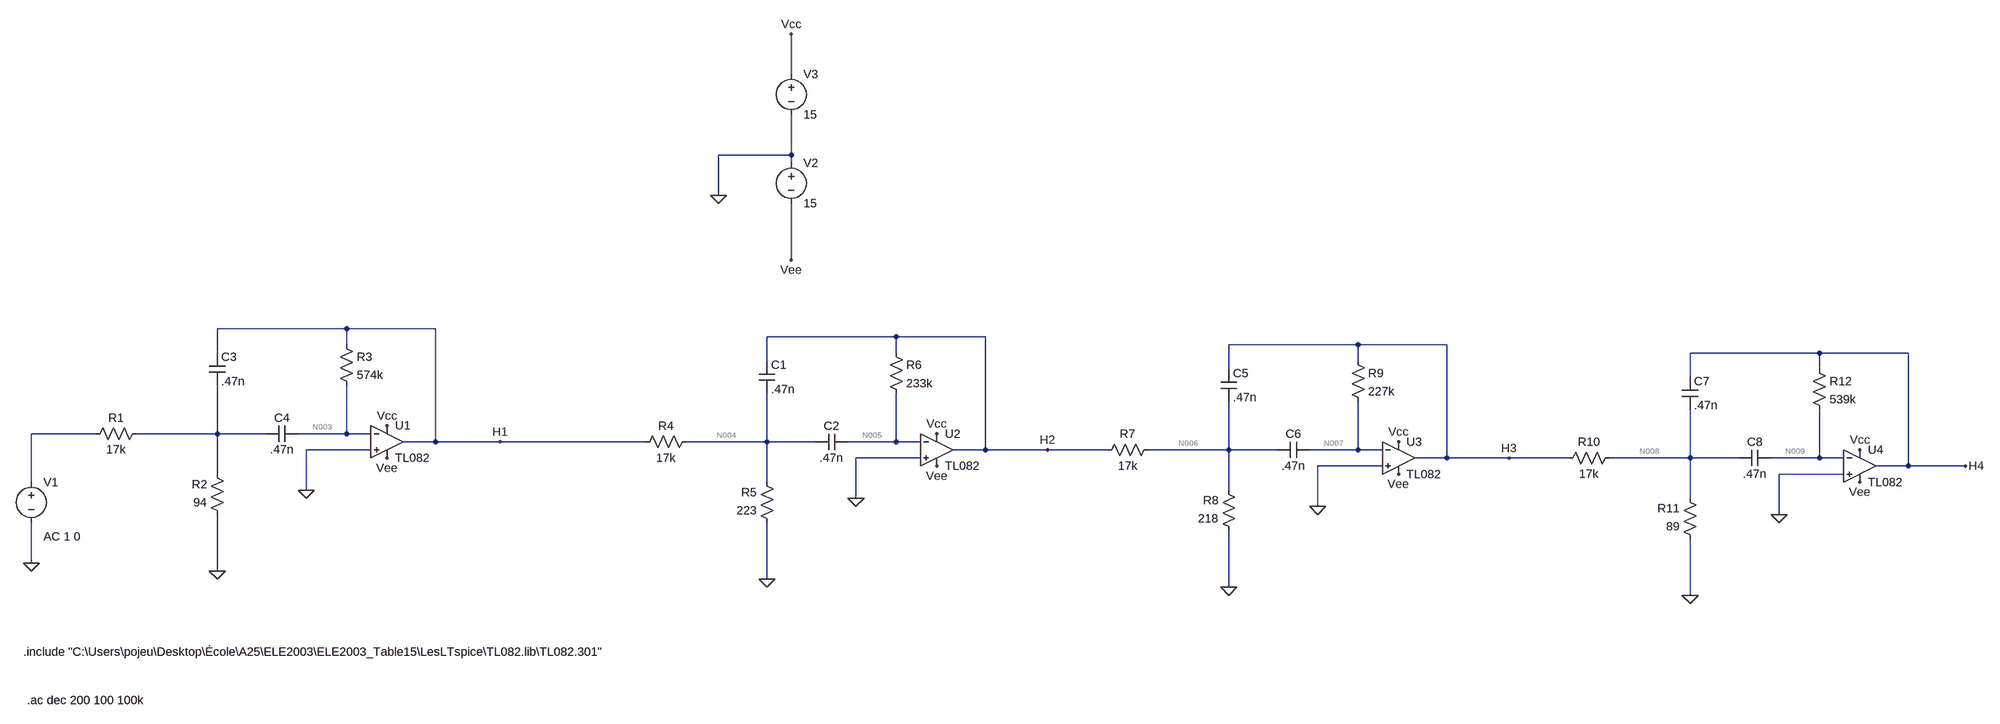
[diagram p0: schematic Filtres assembles.asc]
Filtres assembles.asc, the LTspice schematic file:
Version 4.1
SHEET 1 4064 1060
WIRE 592 -1104 592 -1184
WIRE 592 -944 592 -1024
WIRE 592 -944 448 -944
WIRE 592 -928 592 -944
WIRE 448 -864 448 -944
WIRE 592 -736 592 -848
WIRE -288 -400 -544 -400
WIRE -112 -400 -288 -400
WIRE 800 -384 544 -384
WIRE 976 -384 800 -384
WIRE -288 -368 -288 -400
WIRE 1744 -368 1488 -368
WIRE 1920 -368 1744 -368
WIRE -544 -352 -544 -400
WIRE 800 -352 800 -384
WIRE 2832 -352 2576 -352
WIRE 3008 -352 2832 -352
WIRE 544 -336 544 -384
WIRE 1744 -336 1744 -368
WIRE 1488 -320 1488 -368
WIRE 2832 -320 2832 -352
WIRE 2576 -304 2576 -352
WIRE -784 -192 -912 -192
WIRE -544 -192 -544 -288
WIRE -544 -192 -704 -192
WIRE -448 -192 -544 -192
WIRE -288 -192 -288 -288
WIRE -288 -192 -384 -192
WIRE -240 -192 -288 -192
WIRE -112 -176 -112 -400
WIRE -112 -176 -176 -176
WIRE 16 -176 -112 -176
WIRE 304 -176 16 -176
WIRE 544 -176 544 -272
WIRE 544 -176 384 -176
WIRE 640 -176 544 -176
WIRE 800 -176 800 -272
WIRE 800 -176 704 -176
WIRE 848 -176 800 -176
WIRE -240 -160 -368 -160
WIRE 976 -160 976 -384
WIRE 976 -160 912 -160
WIRE 1104 -160 976 -160
WIRE 1248 -160 1104 -160
WIRE 1488 -160 1488 -256
WIRE 1488 -160 1328 -160
WIRE 1584 -160 1488 -160
WIRE 1744 -160 1744 -256
WIRE 1744 -160 1648 -160
WIRE 1792 -160 1744 -160
WIRE 848 -144 720 -144
WIRE 1920 -144 1920 -368
WIRE 1920 -144 1856 -144
WIRE 2048 -144 1920 -144
WIRE 2336 -144 2048 -144
WIRE 2576 -144 2576 -240
WIRE 2576 -144 2416 -144
WIRE 2672 -144 2576 -144
WIRE 2832 -144 2832 -240
WIRE 2832 -144 2736 -144
WIRE 2880 -144 2832 -144
WIRE 1792 -128 1664 -128
WIRE 3008 -128 3008 -352
WIRE 3008 -128 2944 -128
WIRE 3136 -128 3008 -128
WIRE -544 -112 -544 -192
WIRE 2880 -112 2752 -112
WIRE -912 -96 -912 -192
WIRE 544 -96 544 -176
WIRE -368 -80 -368 -160
WIRE 1488 -80 1488 -160
WIRE 720 -64 720 -144
WIRE 2576 -64 2576 -144
WIRE 1664 -48 1664 -128
WIRE 2752 -32 2752 -112
WIRE -912 64 -912 -16
WIRE -544 80 -544 -32
WIRE 544 96 544 -16
WIRE 1488 112 1488 0
WIRE 2576 128 2576 16
FLAG -544 80 0
FLAG -912 64 0
FLAG 448 -864 0
FLAG 592 -1184 Vcc
FLAG 592 -736 Vee
FLAG -208 -208 Vcc
FLAG -208 -144 Vee
FLAG -368 -80 0
FLAG 544 96 0
FLAG 880 -192 Vcc
FLAG 880 -128 Vee
FLAG 720 -64 0
FLAG 1488 112 0
FLAG 1824 -176 Vcc
FLAG 1824 -112 Vee
FLAG 1664 -48 0
FLAG 2576 128 0
FLAG 2912 -160 Vcc
FLAG 2912 -96 Vee
FLAG 2752 -32 0
FLAG 16 -176 H1
FLAG 1104 -160 H2
FLAG 2048 -144 H3
FLAG 3136 -128 H4
SYMBOL res -688 -208 R90
WINDOW 0 0 56 VBottom 2
WINDOW 3 32 56 VTop 2
SYMATTR InstName R1
SYMATTR Value 17k
SYMBOL res -528 -16 R180
WINDOW 0 36 76 Left 2
WINDOW 3 36 40 Left 2
SYMATTR InstName R2
SYMATTR Value 94
SYMBOL cap -560 -352 R0
SYMATTR InstName C3
SYMATTR Value .47n
SYMBOL cap -384 -208 R90
WINDOW 0 0 32 VBottom 2
WINDOW 3 32 32 VTop 2
SYMATTR InstName C4
SYMATTR Value .47n
SYMBOL res -304 -384 R0
SYMATTR InstName R3
SYMATTR Value 574k
SYMBOL voltage -912 -112 R0
WINDOW 123 24 124 Left 2
WINDOW 39 0 0 Left 0
SYMATTR Value2 AC 1 0
SYMATTR InstName V1
SYMATTR Value ""
SYMBOL voltage 592 -944 R0
SYMATTR InstName V2
SYMATTR Value 15
SYMBOL voltage 592 -1120 R0
SYMATTR InstName V3
SYMATTR Value 15
SYMBOL OpAmps\\opamp2 -208 -240 R0
SYMATTR InstName U1
SYMATTR Value TL082
SYMBOL res 400 -192 R90
WINDOW 0 0 56 VBottom 2
WINDOW 3 32 56 VTop 2
SYMATTR InstName R4
SYMATTR Value 17k
SYMBOL res 560 0 R180
WINDOW 0 36 76 Left 2
WINDOW 3 36 40 Left 2
SYMATTR InstName R5
SYMATTR Value 223
SYMBOL cap 528 -336 R0
SYMATTR InstName C1
SYMATTR Value .47n
SYMBOL cap 704 -192 R90
WINDOW 0 0 32 VBottom 2
WINDOW 3 32 32 VTop 2
SYMATTR InstName C2
SYMATTR Value .47n
SYMBOL res 784 -368 R0
SYMATTR InstName R6
SYMATTR Value 233k
SYMBOL OpAmps\\opamp2 880 -224 R0
SYMATTR InstName U2
SYMATTR Value TL082
SYMBOL res 1344 -176 R90
WINDOW 0 0 56 VBottom 2
WINDOW 3 32 56 VTop 2
SYMATTR InstName R7
SYMATTR Value 17k
SYMBOL res 1504 16 R180
WINDOW 0 36 76 Left 2
WINDOW 3 36 40 Left 2
SYMATTR InstName R8
SYMATTR Value 218
SYMBOL cap 1472 -320 R0
SYMATTR InstName C5
SYMATTR Value .47n
SYMBOL cap 1648 -176 R90
WINDOW 0 0 32 VBottom 2
WINDOW 3 32 32 VTop 2
SYMATTR InstName C6
SYMATTR Value .47n
SYMBOL res 1728 -352 R0
SYMATTR InstName R9
SYMATTR Value 227k
SYMBOL OpAmps\\opamp2 1824 -208 R0
SYMATTR InstName U3
SYMATTR Value TL082
SYMBOL res 2432 -160 R90
WINDOW 0 0 56 VBottom 2
WINDOW 3 32 56 VTop 2
SYMATTR InstName R10
SYMATTR Value 17k
SYMBOL res 2592 32 R180
WINDOW 0 36 76 Left 2
WINDOW 3 36 40 Left 2
SYMATTR InstName R11
SYMATTR Value 89
SYMBOL cap 2560 -304 R0
SYMATTR InstName C7
SYMATTR Value .47n
SYMBOL cap 2736 -160 R90
WINDOW 0 0 32 VBottom 2
WINDOW 3 32 32 VTop 2
SYMATTR InstName C8
SYMATTR Value .47n
SYMBOL res 2816 -336 R0
SYMATTR InstName R12
SYMATTR Value 539k
SYMBOL OpAmps\\opamp2 2912 -192 R0
SYMATTR InstName U4
SYMATTR Value TL082
TEXT -928 240 Left 2 !.include "C:\\Users\\pojeu\\Desktop\\École\\A25\\ELE2003\\ELE2003_Table15\\LesLTspice\\TL082.lib\\TL082.301"
TEXT -920 336 Left 2 !.ac dec 200 100 100k

The netlist it stands for:
* Filtres assembles.asc
R1 N002 N001 17k
R2 0 N002 94
C3 H1 N002 .47n
C4 N003 N002 .47n
R3 H1 N003 574k
V1 N001 0 AC 1 0
V2 0 Vee 15
V3 Vcc 0 15
X§U1 0 N003 Vcc Vee H1 TL082  ; pins In+ In- V+ V- OUT
R4 N004 H1 17k
R5 0 N004 223
C1 H2 N004 .47n
C2 N005 N004 .47n
R6 H2 N005 233k
X§U2 0 N005 Vcc Vee H2 TL082  ; pins In+ In- V+ V- OUT
R7 N006 H2 17k
R8 0 N006 218
C5 H3 N006 .47n
C6 N007 N006 .47n
R9 H3 N007 227k
X§U3 0 N007 Vcc Vee H3 TL082  ; pins In+ In- V+ V- OUT
R10 N008 H3 17k
R11 0 N008 89
C7 H4 N008 .47n
C8 N009 N008 .47n
R12 H4 N009 539k
X§U4 0 N009 Vcc Vee H4 TL082  ; pins In+ In- V+ V- OUT
.include "C:\Users\pojeu\Desktop\École\A25\ELE2003\ELE2003_Table15\LesLTspice\TL082.lib\TL082.301"
.ac dec 200 100 100k
.backanno
.end

* Results of the author's LTspice run, read from the files saved beside the schematic
* Operating Point, zero values left out:
*   V(n003) = 10.97 µV
*   V(vee) = -15 V
*   V(n004) = 476.9 nV
*   V(n006) = 271.8 nV
*   V(n007) = 10.97 µV
*   V(n008) = 110.4 nV
*   V(n009) = 10.97 µV
*   V(h1) = 36.83 µV
*   V(vcc) = 15 V
*   V(h2) = 21.47 µV
*   V(n005) = 10.97 µV
*   V(h3) = 21.2 µV
*   V(h4) = 35.25 µV
*   I(R3) = 45.05 pA
*   I(R4) = -2.138 nA
*   I(R8) = -1.247 nA
*   I(R9) = 45.05 pA
*   I(R10) = -1.24 nA
*   I(V3) = -56.78 mA
*   I(R5) = -2.138 nA
*   I(R6) = 45.05 pA
*   I(R7) = -1.247 nA
*   I(R11) = -1.24 nA
*   I(R12) = 45.05 pA
*   I(V2) = -56.78 mA
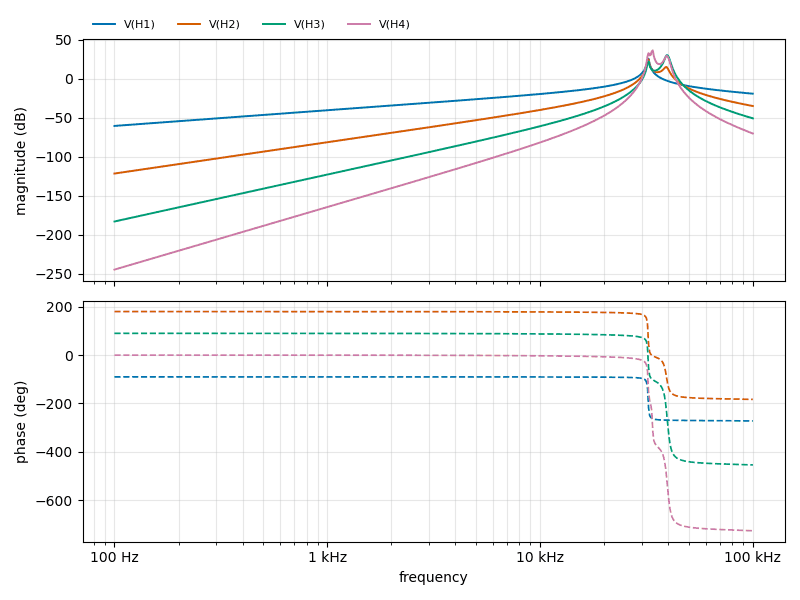
[diagram p1: AC Analysis of Filtres assembles.asc, plotted from the saved traces]
* AC Analysis, 1 run:
*   V(H1): -60.61 dB at 100 Hz, -19.34 dB at 100 kHz, peak 25.38 dB at 32.36 kHz, 3 dB below the peak at 31.89 kHz and 32.53 kHz
*   V(H2): -121.61 dB at 100 Hz, -35.12 dB at 100 kHz, peak 24.39 dB at 32.36 kHz, 3 dB below the peak at 31.92 kHz and 32.54 kHz
*   V(H3): -183.04 dB at 100 Hz, -50.90 dB at 100 kHz, peak 29.89 dB at 39.36 kHz, 3 dB below the peak at 38.79 kHz and 40.34 kHz
*   V(H4): -244.67 dB at 100 Hz, -70.34 dB at 100 kHz, peak 36.13 dB at 33.88 kHz, 3 dB below the peak at 33.35 kHz and 34.04 kHz